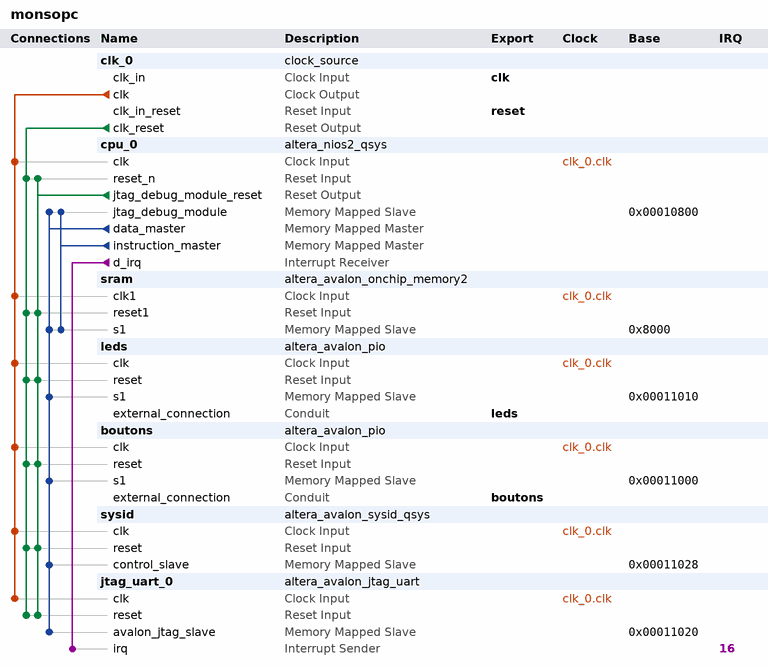
[diagram p0: system contents]
# Platform Designer (Qsys) system monsopc, Cyclone IV E EP4CE22F17C6
# Parameters at their usual value, and those the tool derives, are not listed.
package require -exact qsys 15.0
create_system monsopc
set_project_property DEVICE_FAMILY {Cyclone IV E}
set_project_property DEVICE EP4CE22F17C6

add_instance clk_0 clock_source 15.0
set_instance_parameter_value clk_0 clockFrequency 50000000

add_instance cpu_0 altera_nios2_qsys 15.0
set_instance_parameter_value cpu_0 breakSlave cpu_0.jtag_debug_module
set_instance_parameter_value cpu_0 exceptionSlave sram.s1
set_instance_parameter_value cpu_0 icache_size 4096
set_instance_parameter_value cpu_0 impl Tiny
set_instance_parameter_value cpu_0 mmu_TLBMissExcSlave None
set_instance_parameter_value cpu_0 resetSlave sram.s1
set_instance_parameter_value cpu_0 resetrequest_enabled true

add_instance sram altera_avalon_onchip_memory2 15.0
set_instance_parameter_value sram dataWidth 32
set_instance_parameter_value sram dualPort false
set_instance_parameter_value sram initMemContent true
set_instance_parameter_value sram initializationFileName onchip_mem.hex
set_instance_parameter_value sram memorySize 20000

add_instance leds altera_avalon_pio 15.0
set_instance_parameter_value leds direction Output
set_instance_parameter_value leds width 8

add_instance boutons altera_avalon_pio 15.0
set_instance_parameter_value boutons direction Input
set_instance_parameter_value boutons width 2

add_instance sysid altera_avalon_sysid_qsys 15.0
set_instance_parameter_value sysid id 0

add_instance jtag_uart_0 altera_avalon_jtag_uart 15.0
set_instance_parameter_value jtag_uart_0 simInteractiveOptions NO_INTERACTIVE_WINDOWS

# connections
add_connection clk_0.clk boutons.clk clock
add_connection clk_0.clk cpu_0.clk clock
add_connection clk_0.clk jtag_uart_0.clk clock
add_connection clk_0.clk leds.clk clock
add_connection clk_0.clk sram.clk1 clock
add_connection clk_0.clk sysid.clk clock
add_connection clk_0.clk_reset boutons.reset reset
add_connection clk_0.clk_reset cpu_0.reset_n reset
add_connection clk_0.clk_reset jtag_uart_0.reset reset
add_connection clk_0.clk_reset leds.reset reset
add_connection clk_0.clk_reset sram.reset1 reset
add_connection clk_0.clk_reset sysid.reset reset
add_connection cpu_0.jtag_debug_module_reset boutons.reset reset
add_connection cpu_0.jtag_debug_module_reset cpu_0.reset_n reset
add_connection cpu_0.jtag_debug_module_reset jtag_uart_0.reset reset
add_connection cpu_0.jtag_debug_module_reset leds.reset reset
add_connection cpu_0.jtag_debug_module_reset sram.reset1 reset
add_connection cpu_0.jtag_debug_module_reset sysid.reset reset
add_connection cpu_0.data_master boutons.s1 avalon
set_connection_parameter_value cpu_0.data_master/boutons.s1 baseAddress 0x00011000
add_connection cpu_0.data_master cpu_0.jtag_debug_module avalon
set_connection_parameter_value cpu_0.data_master/cpu_0.jtag_debug_module baseAddress 0x00010800
add_connection cpu_0.data_master jtag_uart_0.avalon_jtag_slave avalon
set_connection_parameter_value cpu_0.data_master/jtag_uart_0.avalon_jtag_slave baseAddress 0x00011020
add_connection cpu_0.data_master leds.s1 avalon
set_connection_parameter_value cpu_0.data_master/leds.s1 baseAddress 0x00011010
add_connection cpu_0.data_master sram.s1 avalon
set_connection_parameter_value cpu_0.data_master/sram.s1 baseAddress 0x8000
add_connection cpu_0.data_master sysid.control_slave avalon
set_connection_parameter_value cpu_0.data_master/sysid.control_slave baseAddress 0x00011028
add_connection cpu_0.instruction_master cpu_0.jtag_debug_module avalon
set_connection_parameter_value cpu_0.instruction_master/cpu_0.jtag_debug_module baseAddress 0x00010800
add_connection cpu_0.instruction_master sram.s1 avalon
set_connection_parameter_value cpu_0.instruction_master/sram.s1 baseAddress 0x8000
add_connection cpu_0.d_irq jtag_uart_0.irq interrupt
set_connection_parameter_value cpu_0.d_irq/jtag_uart_0.irq irqNumber 16

# exported interfaces
add_interface boutons conduit end
set_interface_property boutons EXPORT_OF boutons.external_connection
add_interface clk clock sink
set_interface_property clk EXPORT_OF clk_0.clk_in
add_interface leds conduit end
set_interface_property leds EXPORT_OF leds.external_connection
add_interface reset reset sink
set_interface_property reset EXPORT_OF clk_0.clk_in_reset

set_interconnect_requirement {$system} qsys_mm.clockCrossingAdapter HANDSHAKE
set_interconnect_requirement {$system} qsys_mm.enableEccProtection FALSE
set_interconnect_requirement {$system} qsys_mm.insertDefaultSlave FALSE
set_interconnect_requirement {$system} qsys_mm.maxAdditionalLatency 1

save_system monsopc.qsys
